# Altium schematic sheet wifi.schdoc: DevelBoard EVA01 WiFi Module.
size A3; Author: Daniele Basile <asterix@develer.com>; Organization: Develer s.r.l.; Address1: via Mugellese 1/A; Address2: 50019 Campi Bisenzio; Address3: Firenze; Address4: ITALY; DocumentNumber: 6; Revision: B; SheetNumber: 6; SheetTotal: 6; Hw_rev: R2
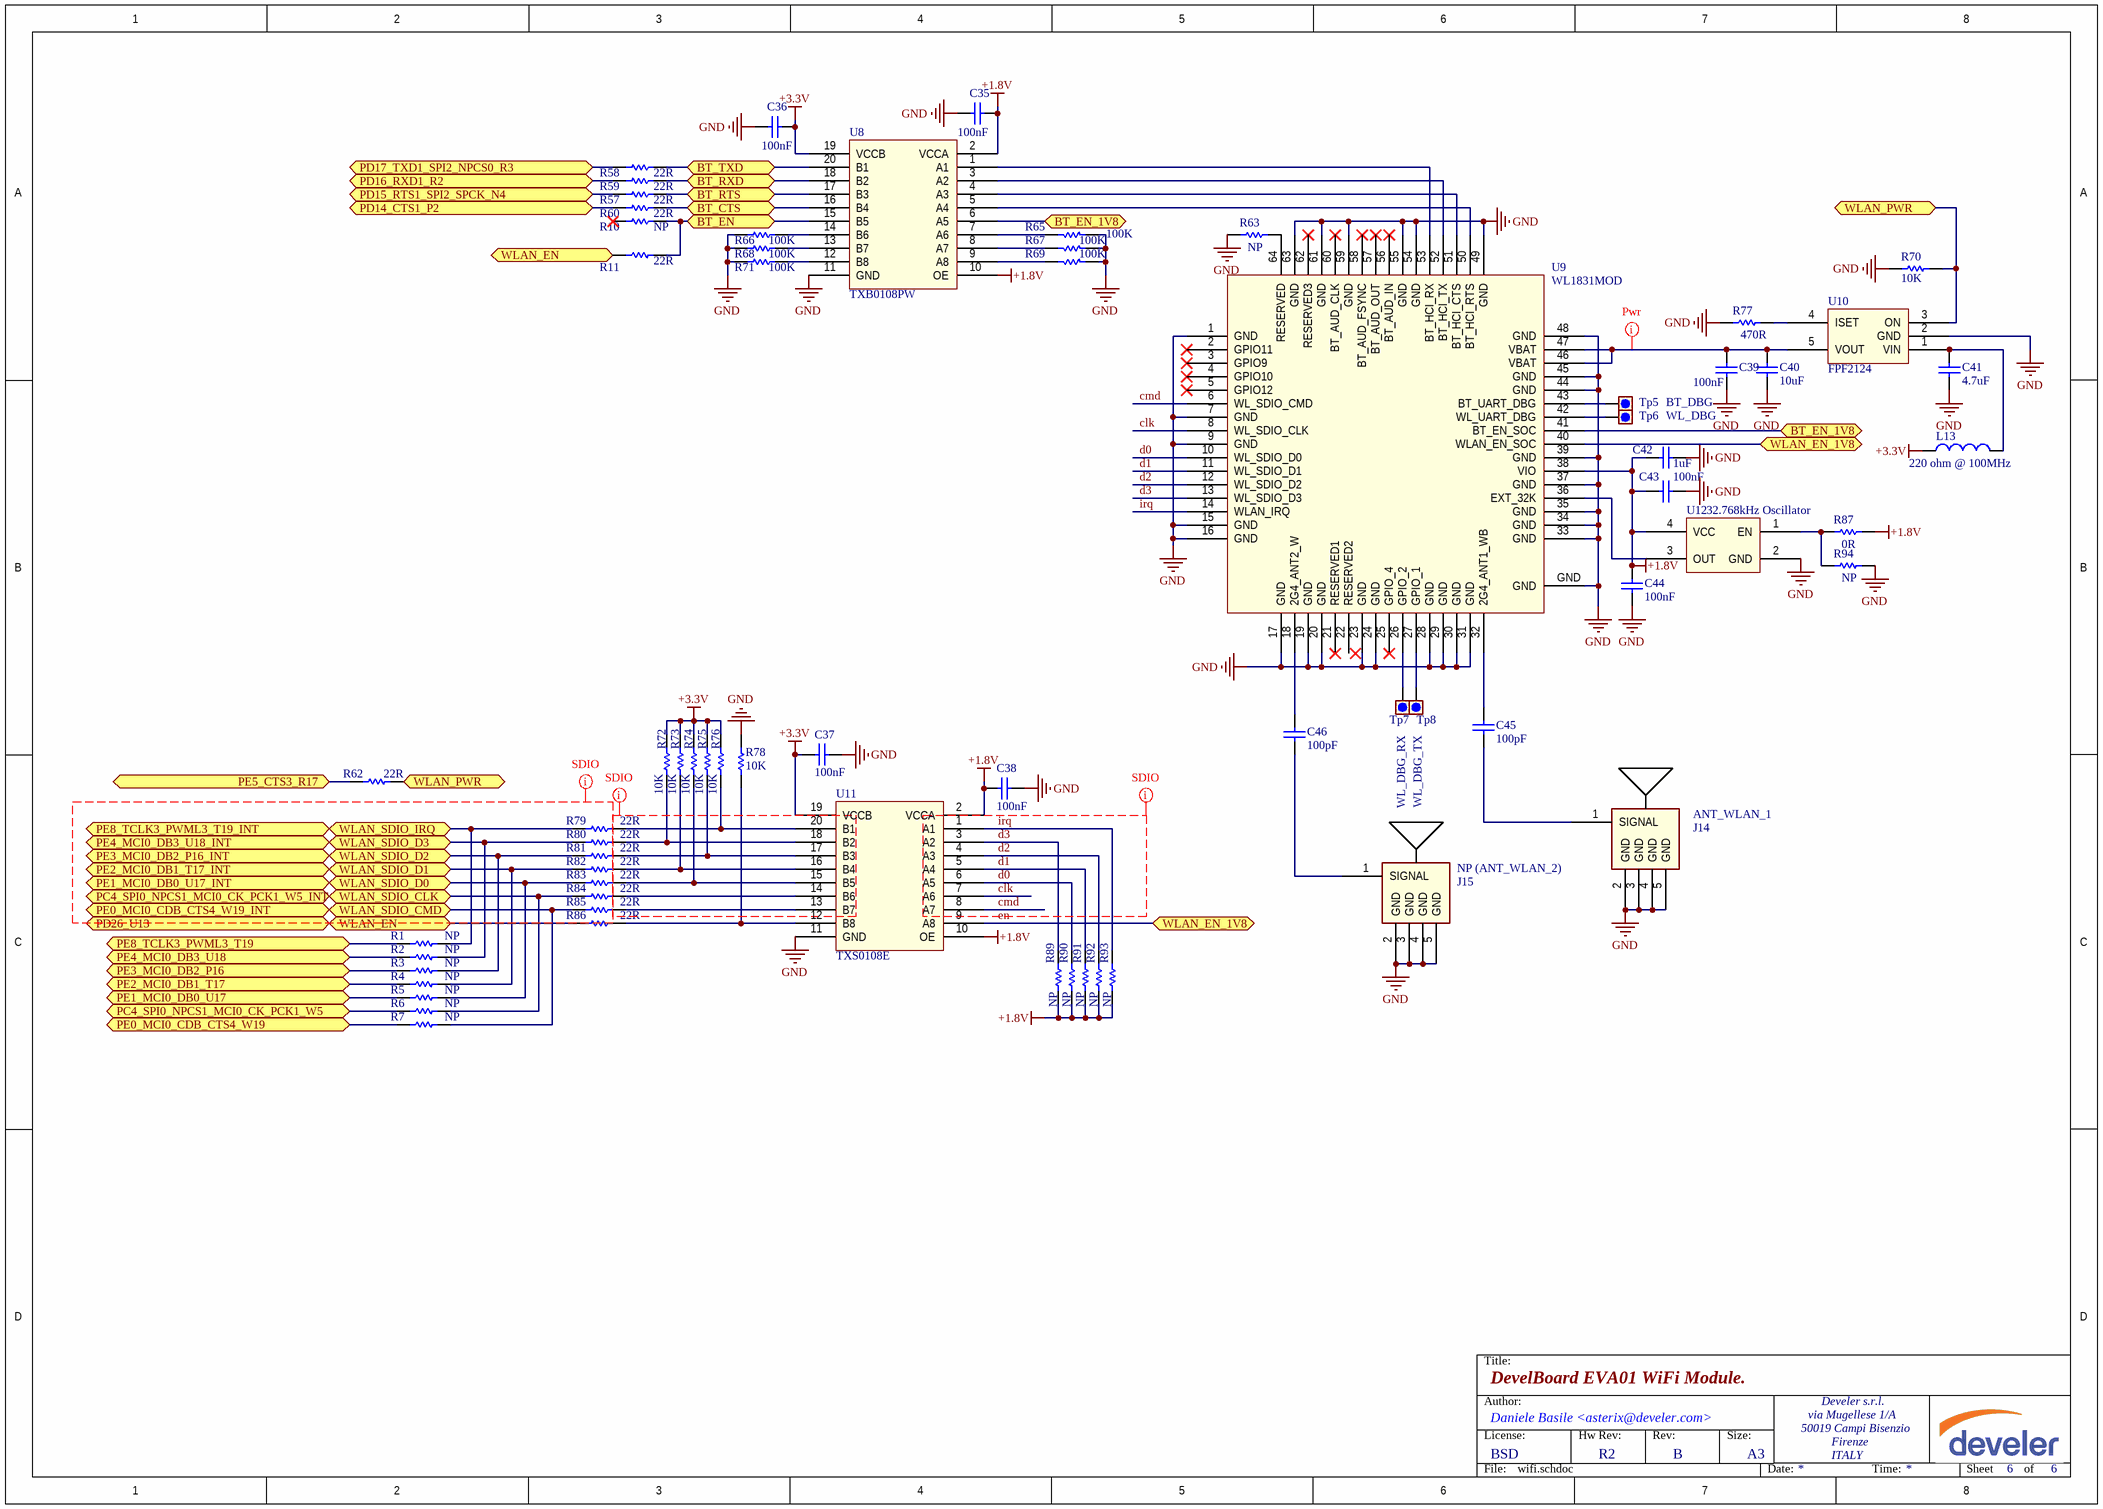
[diagram p0: wifi.schdoc]

## Parts
C35  100nF  [0603_[1608]]
C36  100nF  [0603_[1608]]
C37  100nF  [0603_[1608]]
C38  100nF  [0603_[1608]]
C39  100nF  [0603_[1608]]
C40  10uF  [1206_[3216]]
C41  4.7uF  [0805_[2012]]
C42  1uF  [1206_[3216]]
C43  100nF  [0603_[1608]]
C44  100nF  [0603_[1608]]
C45  100pF  [0603_[1608]]
C46  100pF  [0603_[1608]]
J14  ANT_WLAN_1  [SMA_Jack_Female_5.08mm_THD]
J15  NP (ANT_WLAN_2)  [SMA_Jack_Female_5.08mm_THD]
L13  220 ohm @ 100MHz  [0805_[2012]]
R1  NP  [0603_[1608]]
R2  NP  [0603_[1608]]
R3  NP  [0603_[1608]]
R4  NP  [0603_[1608]]
R5  NP  [0603_[1608]]
R6  NP  [0603_[1608]]
R7  NP  [0603_[1608]]
R10  NP  [0603_[1608]]
R11  22R  [0603_[1608]]
R57  22R  [0603_[1608]]
R58  22R  [0603_[1608]]
R59  22R  [0603_[1608]]
R60  22R  [0603_[1608]]
R62  22R  [0603_[1608]]
R63  NP  [0603_[1608]]
R65  100K  [0603_[1608]]
R66  100K  [0603_[1608]]
R67  100K  [0603_[1608]]
R68  100K  [0603_[1608]]
R69  100K  [0603_[1608]]
R70  10K  [0603_[1608]]
R71  100K  [0603_[1608]]
R72  10K  [0603_[1608]]
R73  10K  [0603_[1608]]
R74  10K  [0603_[1608]]
R75  10K  [0603_[1608]]
R76  10K  [0603_[1608]]
R77  470R  [0603_[1608]]
R78  10K  [0603_[1608]]
R79  22R  [0603_[1608]]
R80  22R  [0603_[1608]]
R81  22R  [0603_[1608]]
R82  22R  [0603_[1608]]
R83  22R  [0603_[1608]]
R84  22R  [0603_[1608]]
R85  22R  [0603_[1608]]
R86  22R  [0603_[1608]]
R87  0R  [0603_[1608]]
R89  NP  [0603_[1608]]
R90  NP  [0603_[1608]]
R91  NP  [0603_[1608]]
R92  NP  [0603_[1608]]
R93  NP  [0603_[1608]]
R94  NP  [0603_[1608]]
Tp5  BT_DBG  [TEST_POINT_SMD_D1MM]  (no BOM)
Tp6  WL_DBG  [TEST_POINT_SMD_D1MM]  (no BOM)
Tp7  WL_DBG_RX  [TEST_POINT_SMD_D1MM]  (no BOM)
Tp8  WL_DBG_TX  [TEST_POINT_SMD_D1MM]  (no BOM)
U8  TXB0108PW  [TSOP65P640X120-20L]
U9  WL1831MOD  [WL18XX_E-13.4X13.3-N100_0.75]
U10  FPF2124  [SOT-23-5]
U11  TXS0108E  [TSOP65P640X120-20L]
U12  32.768kHz Oscillator  [CRYSTAL_3.2X1.5MM_4P_SMD]

## Ports
BT_CTS, BT_EN, BT_EN_1V8, BT_RTS, BT_RXD, BT_TXD, PC4_SPI0_NPCS1_MCI0_CK_PCK1_W5, PC4_SPI0_NPCS1_MCI0_CK_PCK1_W5_INT, PD14_CTS1_P2, PD15_RTS1_SPI2_SPCK_N4, PD16_RXD1_R2, PD17_TXD1_SPI2_NPCS0_R3, PD26_U13, PE0_MCI0_CDB_CTS4_W19, PE0_MCI0_CDB_CTS4_W19_INT, PE1_MCI0_DB0_U17, PE1_MCI0_DB0_U17_INT, PE2_MCI0_DB1_T17, PE2_MCI0_DB1_T17_INT, PE3_MCI0_DB2_P16, PE3_MCI0_DB2_P16_INT, PE4_MCI0_DB3_U18, PE4_MCI0_DB3_U18_INT, PE5_CTS3_R17, PE8_TCLK3_PWML3_T19, PE8_TCLK3_PWML3_T19_INT, WLAN_EN, WLAN_EN_1V8, WLAN_PWR, WLAN_SDIO_CLK, WLAN_SDIO_CMD, WLAN_SDIO_D0, WLAN_SDIO_D1, WLAN_SDIO_D2, WLAN_SDIO_D3, WLAN_SDIO_IRQ

## Nets
+1.8V: C35.2 C38.2 C42.2 C43.2 C44.2 R87.1 R89.1 R90.1 R91.1 R92.1 R93.1 U8.2(VCCA) U8.10(OE) U9.38(VIO) U11.2(VCCA) U11.10(OE) U12.4(VCC)
+3.3V: C36.2 C37.2 L13.2 R72.1 R73.1 R74.1 R75.1 R76.1 U8.19(VCCB) U11.19(VCCB)
GND: C35.1 C36.1 C37.1 C38.1 C39.1 C40.1 C41.1 C42.1 C43.1 C44.1 J14.2(GND) J14.3(GND) J14.4(GND) J14.5(GND) J15.2(GND) J15.3(GND) J15.4(GND) J15.5(GND) R63.2 R65.2 R66.2 R67.2 R68.2 R69.2 R70.1 R71.2 R77.2 R78.1 R94.1 U8.11(GND) U9.1(GND) U9.7(GND) U9.9(GND) U9.15(GND) U9.16(GND) U9.17(GND) U9.19(GND) U9.20(GND) U9.23(GND) U9.24(GND) U9.28(GND) U9.29(GND) U9.30(GND) U9.31(GND) U9.33(GND) U9.34(GND) U9.35(GND) U9.37(GND) U9.39(GND) U9.44(GND) U9.45(GND) U9.48(GND) U9.49(GND) U9.54(GND) U9.55(GND) U9.59(GND) U9.61(GND) U9.63(GND) U9.GND U10.2(GND) U11.11(GND) U12.2(GND)
BT_CTS: R60.2 U8.16(B4) ; port BT_CTS
BT_EN: R10.2 R11.2 U8.15(B5) ; port BT_EN
BT_EN_1V8: U8.6(A5) U9.41(BT_EN_SOC) ; port BT_EN_1V8
BT_RTS: R57.2 U8.17(B3) ; port BT_RTS
BT_RXD: R59.2 U8.18(B2) ; port BT_RXD
BT_TXD: R58.2 U8.20(B1) ; port BT_TXD
clk: U9.8(WL_SDIO_CLK) U11.7(A6)
cmd: U9.6(WL_SDIO_CMD) U11.8(A7)
d0: R90.2 U9.10(WL_SDIO_D0) U11.6(A5)
d1: R91.2 U9.11(WL_SDIO_D1) U11.5(A4)
d2: R92.2 U9.12(WL_SDIO_D2) U11.4(A3)
d3: R89.2 U9.13(WL_SDIO_D3) U11.3(A2)
en: U9.40(WLAN_EN_SOC) U11.9(A8) ; port WLAN_EN_1V8
irq: R93.2 U9.14(WLAN_IRQ) U11.1(A1)
PC4_SPI0_NPCS1_MCI0_CK_PCK1_W5: R6.2 ; port PC4_SPI0_NPCS1_MCI0_CK_PCK1_W5
PC4_SPI0_NPCS1_MCI0_CK_PCK1_W5_INT: R6.1 R84.2 ; port WLAN_SDIO_CLK, port PC4_SPI0_NPCS1_MCI0_CK_PCK1_W5_INT
PD14_CTS1_P2: R60.1 ; port PD14_CTS1_P2
PD15_RTS1_SPI2_SPCK_N4: R57.1 ; port PD15_RTS1_SPI2_SPCK_N4
PD16_RXD1_R2: R59.1 ; port PD16_RXD1_R2
PD17_TXD1_SPI2_NPCS0_R3: R58.1 ; port PD17_TXD1_SPI2_NPCS0_R3
PD26_U13: R11.1 R86.2 ; port WLAN_EN, port PD26_U13
PE0_MCI0_CDB_CTS4_W19: R7.2 ; port PE0_MCI0_CDB_CTS4_W19
PE0_MCI0_CDB_CTS4_W19_INT: R7.1 R85.2 ; port WLAN_SDIO_CMD, port PE0_MCI0_CDB_CTS4_W19_INT
PE1_MCI0_DB0_U17: R5.2 ; port PE1_MCI0_DB0_U17
PE1_MCI0_DB0_U17_INT: R5.1 R83.2 ; port WLAN_SDIO_D0, port PE1_MCI0_DB0_U17_INT
PE2_MCI0_DB1_T17: R4.2 ; port PE2_MCI0_DB1_T17
PE2_MCI0_DB1_T17_INT: R4.1 R82.2 ; port WLAN_SDIO_D1, port PE2_MCI0_DB1_T17_INT
PE3_MCI0_DB2_P16: R3.2 ; port PE3_MCI0_DB2_P16
PE3_MCI0_DB2_P16_INT: R3.1 R81.2 ; port WLAN_SDIO_D2, port PE3_MCI0_DB2_P16_INT
PE4_MCI0_DB3_U18: R2.2 ; port PE4_MCI0_DB3_U18
PE4_MCI0_DB3_U18_INT: R2.1 R80.2 ; port WLAN_SDIO_D3, port PE4_MCI0_DB3_U18_INT
PE5_CTS3_R17: R62.1 ; port PE5_CTS3_R17
PE8_TCLK3_PWML3_T19: R1.2 ; port PE8_TCLK3_PWML3_T19
PE8_TCLK3_PWML3_T19_INT: R1.1 R79.2 ; port WLAN_SDIO_IRQ, port PE8_TCLK3_PWML3_T19_INT
WLAN_PWR: R62.2 R70.2 U10.3(ON) ; port WLAN_PWR
NetC39_2: C39.2 C40.2 U9.46(VBAT) U9.47(VBAT) U10.5(VOUT)
NetC41_2: C41.2 L13.1 U10.1(VIN)
NetC45_1: C45.1 U9.32(2G4_ANT1_WB)
NetC45_2: C45.2 J14.1(SIGNAL)
NetC46_1: C46.1 U9.18(2G4_ANT2_W)
NetC46_2: C46.2 J15.1(SIGNAL)
NetR63_1: R63.1 U9.64(RESERVED)
NetR65_1: R65.1 U8.7(A6)
NetR66_1: R66.1 U8.14(B6)
NetR67_1: R67.1 U8.8(A7)
NetR68_1: R68.1 U8.13(B7)
NetR69_1: R69.1 U8.9(A8)
NetR71_1: R71.1 U8.12(B8)
NetR72_2: R72.2 R80.1 U11.18(B2)
NetR73_2: R73.2 R82.1 U11.16(B4)
NetR74_2: R74.2 R83.1 U11.15(B5)
NetR75_2: R75.2 R81.1 U11.17(B3)
NetR76_2: R76.2 R79.1 U11.20(B1)
NetR77_1: R77.1 U10.4(ISET)
NetR78_2: R78.2 R86.1 U11.12(B8)
NetR84_1: R84.1 U11.14(B6)
NetR85_1: R85.1 U11.13(B7)
NetR87_2: R87.2 R94.2 U12.1(EN)
NetTp5_1: Tp5.1 U9.43(BT_UART_DBG)
NetTp6_1: Tp6.1 U9.42(WL_UART_DBG)
NetTp7_1: Tp7.1 U9.26(GPIO_2)
NetTp8_1: Tp8.1 U9.27(GPIO_1)
NetU8_1: U8.1(A1) U9.53(BT_HCI_RX)
NetU8_3: U8.3(A2) U9.52(BT_HCI_TX)
NetU8_4: U8.4(A3) U9.51(BT_HCI_CTS)
NetU8_5: U8.5(A4) U9.50(BT_HCI_RTS)
NetU9_36: U9.36(EXT_32K) U12.3(OUT)

Not connected (* = marked no-connect by the designer): R10 1*; U9 2(GPIO11)* 3(GPIO9)* 4(GPIO10)* 5(GPIO12)* 21(RESERVED1)* 22(RESERVED2) 25(GPIO_4)* 56(BT_AUD_IN)* 57(BT_AUD_OUT)* 58(BT_AUD_FSYNC)* 60(BT_AUD_CLK)* 62(RESERVED3)*

## Layout directives
net class Power: NetC39_2
net class SDIO_BUS: (no net found under the mark)
net class SDIO: (no net found under the mark)
net class SDIO_LOWBUS: clk, cmd, d0, d1, d2, d3, irq

## Notes on the sheet
- Title:
- Author:
- License:
- BSD
- Hw Rev:
- Rev:
- Size:
- A3
- File:
- Date:
- Time:
- Sheet
- of

## Library data of the parts
C35-C39 C42-C44 = Cap: Ceramic X7R 50V; Value: 10nF; Published: 8-Jun-2000; Revision: July-2002: Re-released for DXP Platform.; Publisher: Altium Limited
C40 = Cap: Ceramic X5R 25V; Value: 10nF; Published: 8-Jun-2000; Revision: July-2002: Re-released for DXP Platform.; Publisher: Altium Limited
C41 = Cap: Ceramic X7R 10V; Value: 10nF; Published: 8-Jun-2000; Revision: July-2002: Re-released for DXP Platform.; Publisher: Altium Limited
C45 C46 = Cap: Ceramic COG 50V; Value: 10nF; Published: 8-Jun-2000; Revision: July-2002: Re-released for DXP Platform.; Publisher: Altium Limited
J14 J15 = ANTENNA: SMA, Jack, Right angle, PCB socket, 50ohm (TE 5-1814400-1)
L13 = Inductor: Ferrite Beat (WE 742792022)
R1-R7 R10 R11 R57-R60 R62 R63 R65-R87 R89-R94 = Res1: Resistor; Value: 1K; Published: 8-Jun-2000; Revision: July-2002: Re-released for DXP Platform.; Publisher: Altium Limited
Tp5-Tp8 = Test_point: Test point
U8 U11 = TXB0108PW: 8-bit bidirectional level translator
U9 = WL1831MOD: Wifi & Bluethoot module
U10 = FPF2124: Power Load Switch
U12 = Si501/2/3_32768Hz: 32.768kHz Oscillator (EPSON  X1B0002110001 SG-3030CM)